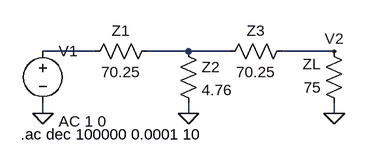
[diagram p0: schematic ts14-ej1.asc]
ts14-ej1.asc, the LTspice schematic file:
Version 4
SHEET 1 880 680
WIRE 16 128 -64 128
WIRE 160 128 96 128
WIRE 224 128 160 128
WIRE 384 128 304 128
WIRE -64 224 -64 208
WIRE 160 224 160 208
WIRE 384 224 384 208
FLAG 160 224 0
FLAG 384 224 0
FLAG -64 224 0
FLAG 384 128 V2
SYMBOL res 112 112 R90
WINDOW 0 0 56 VBottom 2
WINDOW 3 32 56 VTop 2
SYMATTR InstName Z1
SYMATTR Value 70.25
SYMBOL res 144 112 R0
SYMATTR InstName Z2
SYMATTR Value 4.76
SYMBOL res 320 112 R90
WINDOW 0 0 56 VBottom 2
WINDOW 3 32 56 VTop 2
SYMATTR InstName Z3
SYMATTR Value 70.25
SYMBOL res 400 224 R180
WINDOW 0 36 76 Left 2
WINDOW 3 36 40 Left 2
SYMATTR InstName ZL
SYMATTR Value 75
SYMBOL voltage -64 112 R0
WINDOW 123 24 124 Left 2
WINDOW 39 0 0 Left 0
SYMATTR InstName V1
SYMATTR Value ""
SYMATTR Value2 AC 1 0
TEXT -98 256 Left 2 !.ac dec 100000 0.0001 10

The netlist it stands for:
* ts14-ej1.asc
R§Z1 N002 N001 70.25
R§Z2 N002 0 4.76
R§Z3 V2 N002 70.25
R§ZL 0 V2 75
V1 N001 0 AC 1 0
.ac dec 100000 0.0001 10
.backanno
.end